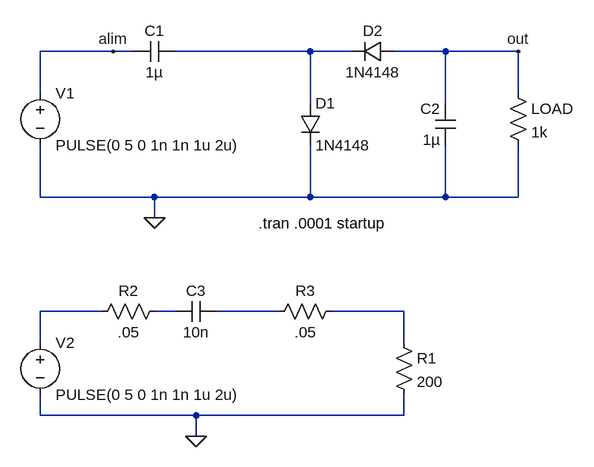
[diagram p0: schematic tmp.asc]
tmp.asc, the LTspice schematic file:
Version 4
SHEET 1 880 680
WIRE 16 48 -96 48
WIRE 48 48 16 48
WIRE 320 48 112 48
WIRE 384 48 320 48
WIRE 528 48 448 48
WIRE 640 48 528 48
WIRE -96 112 -96 48
WIRE 640 112 640 48
WIRE 320 128 320 48
WIRE 528 128 528 48
WIRE -96 272 -96 192
WIRE 80 272 -96 272
WIRE 320 272 320 192
WIRE 320 272 80 272
WIRE 528 272 528 192
WIRE 528 272 320 272
WIRE 640 272 640 192
WIRE 640 272 528 272
WIRE 80 304 80 272
WIRE 0 448 -96 448
WIRE 112 448 80 448
WIRE 272 448 176 448
WIRE 464 448 352 448
WIRE -96 496 -96 448
WIRE 464 496 464 448
WIRE -96 608 -96 576
WIRE 144 608 -96 608
WIRE 464 608 464 576
WIRE 464 608 144 608
WIRE 144 640 144 608
FLAG 80 304 0
FLAG 640 48 out
FLAG 16 48 alim
FLAG 144 640 0
SYMBOL voltage -96 96 R0
WINDOW 123 0 0 Left 0
WINDOW 39 0 0 Left 0
SYMATTR InstName V1
SYMATTR Value PULSE(0 5 0 1n 1n 1u 2u)
SYMBOL cap 112 32 R90
WINDOW 0 0 32 VBottom 2
WINDOW 3 32 32 VTop 2
SYMATTR InstName C1
SYMATTR Value 1µ
SYMBOL res 624 96 R0
SYMATTR InstName LOAD
SYMATTR Value 1k
SYMBOL diode 304 128 R0
SYMATTR InstName D1
SYMATTR Value 1N4148
SYMBOL diode 448 32 R90
WINDOW 0 0 32 VBottom 2
WINDOW 3 32 32 VTop 2
SYMATTR InstName D2
SYMATTR Value 1N4148
SYMBOL cap 544 192 R180
WINDOW 0 24 56 Left 2
WINDOW 3 24 8 Left 2
SYMATTR InstName C2
SYMATTR Value 1µ
SYMBOL voltage -96 480 R0
WINDOW 123 0 0 Left 0
WINDOW 39 0 0 Left 0
SYMATTR InstName V2
SYMATTR Value PULSE(0 5 0 1n 1n 1u 2u)
SYMBOL res 448 480 R0
SYMATTR InstName R1
SYMATTR Value 200
SYMBOL cap 176 432 R90
WINDOW 0 0 32 VBottom 2
WINDOW 3 32 32 VTop 2
SYMATTR InstName C3
SYMATTR Value 10n
SYMBOL res 96 432 R90
WINDOW 0 0 56 VBottom 2
WINDOW 3 32 56 VTop 2
SYMATTR InstName R2
SYMATTR Value .05
SYMBOL res 368 432 R90
WINDOW 0 0 56 VBottom 2
WINDOW 3 32 56 VTop 2
SYMATTR InstName R3
SYMATTR Value .05
TEXT 240 312 Left 2 !.tran .0001 startup

The netlist it stands for:
* tmp.asc
V1 alim 0 PULSE(0 5 0 1n 1n 1u 2u)
C1 N001 alim 1µ
R§LOAD out 0 1k
D1 N001 0 1N4148
D2 out N001 1N4148
C2 0 out 1µ
V2 N002 0 PULSE(0 5 0 1n 1n 1u 2u)
R1 N005 0 200
C3 N004 N003 10n
R2 N003 N002 .05
R3 N005 N004 .05
.model D D
.lib standard.dio
.tran .0001 startup
.backanno
.end